# Altium schematic sheet LiPoBattery.SchDoc
size A4; SheetNumber: 1; SheetTotal: 1
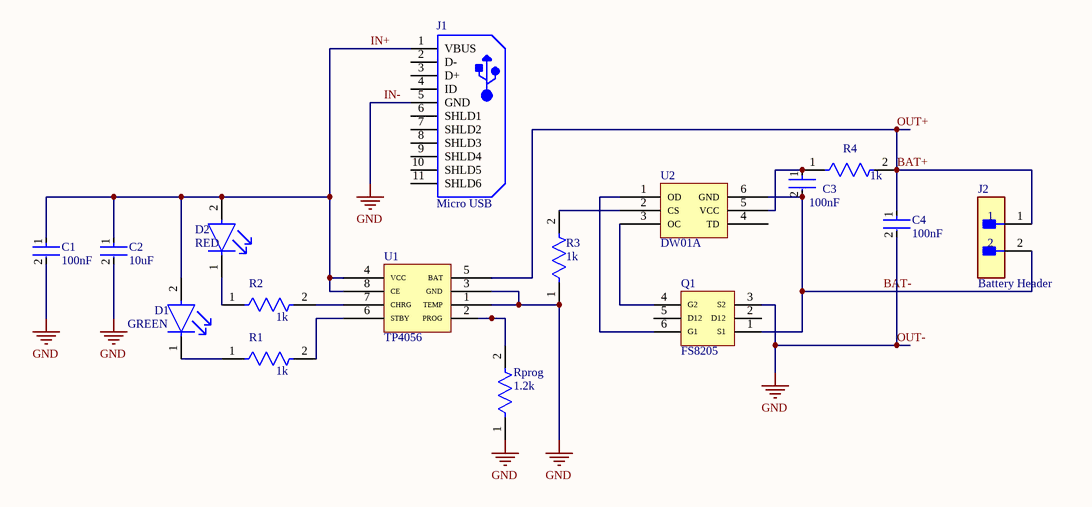
[diagram p0: LiPoBattery.SchDoc]

## Parts
C1  100nF  [FP-CGA3E-0_3-0_1-IPC_B]
C2  10uF  [FP-CGA4J-IPC_B]
C3  100nF  [FP-CGA3E-0_3-0_1-IPC_B]
C4  100nF  [FP-CGA3E-0_3-0_1-IPC_B]
D1  GREEN  [FP-APHCM2012CGCK-F01-MFG]
D2  RED  [FP-LTST-C190KRKT-MFG]
J1  Micro USB  [FCI-10118193-0001LF-5_V]
J2  Battery Header  [FP-B2B-PH-K_LF_SN-MFG]
Q1  FS8205  [SOT95P280X145-6N]
R1  1k  [FP-CRGCQ0402-IPC_C]
R2  1k  [FP-CRGCQ0402-IPC_C]
R3  1k  [FP-CRGCQ0402-IPC_C]
R4  1k  [FP-RNCP0402-IPC_A]
Rprog  1.2k  [FP-MCU0805-MFG]
U1  TP4056  [SOIC127P600X265-8N]
U2  DW01A  [SOT95P280X145-6N]

## Nets
IN-: C1.2 C2.2 C4.2 J1.5(GND) Q1.3(S2) R3.1 Rprog.1 U1.1(TEMP) U1.3(GND)  [also labelled GND, OUT-]
BAT+: C4.1 J2.1 R4.2 U1.5(BAT)  [also labelled OUT+]
BAT-: C3.2 J2.2 Q1.1(S1) U2.6(GND)
IN+: C1.1 C2.1 D1.2(A) D2.2(A) J1.1(VBUS) U1.4(VCC) U1.8(CE)
NetC3_1: C3.1 R4.1 U2.5(VCC)
NetD1_1: D1.1(C) R1.1
NetD2_1: D2.1(C) R2.1
NetQ1_4: Q1.4(G2) U2.3(OC)
NetQ1_6: Q1.6(G1) U2.1(OD)
NetR1_2: R1.2 U1.6(STBY)
NetR2_2: R2.2 U1.7(CHRG)
NetR3_2: R3.2 U2.2(CS)
NetRprog_2: Rprog.2 U1.2(PROG)

Not connected (* = marked no-connect by the designer): J1 2(D-) 3(D+) 4(ID) 6(SHLD1) 7(SHLD2) 8(SHLD3) 9(SHLD4) 10(SHLD5) 11(SHLD6); Q1 2(D12) 5(D12); U2 4(TD)

## Library data of the parts
C1 C3 C4 = CMP-08246-001006-1: Cap Ceramic 100nF 25V X8R 20% Pad SMD 0603 +150°C Automotive T/R; Package Quantity: 4000; Voltage Rating: 25V; Ratings: AEC-Q200; Mount: Surface Mount; Case/Package: 0603; Features: High Temperature; Case Code (Metric): 1608; Height: 0.8mm; Case Code (Imperial): 0603; Min Operating Temperature: -55°C; Packaging: Tape and Reel; Thickness: 0.035inch; Dielectric: X8R; Tolerance: 20%; Width: 0.031inch; Length: 0.063inch; Capacitance: 100nF; Max Operating Temperature: 150°C; Weight: 7.1E-05oz; Voltage Rating (DC): 25V
C2 = CMP-08246-002209-1: Cap Ceramic 10uF 10V X5R 20% Pad SMD 0805 +85°C Automotive T/R; Case Code (Imperial): 0805; Mount: Surface Mount; Min Operating Temperature: -55°C; Tolerance: 20%; Length: 0.079inch; Capacitance: 10uF; Voltage Rating: 10V; Case Code (Metric): 2012; Width: 0.049inch; Ratings: AEC-Q200; Max Operating Temperature: 85°C; Package Quantity: 2000; Thickness: 0.057inch; Packaging: Tape and Reel; Case/Package: 0805
D1 = CMP-44529-000062-1: LED GREEN CLEAR CHIP SMD; Dominant Wavelength: 570nm; Forward Current: 20mA; Number of LEDs: 1; Luminous Intensity: 40mcd; Forward Voltage: 2.1V; Viewing Angle: 110°; Illumination Color: Green; Lens Style: Clear; Mount: Surface Mount; Length: 2mm; Max Operating Temperature: 85°C; Series: APHCM; Width: 1.25mm; Lead Free: Lead Free; Wavelength: 570nm; Package Quantity: 1; Number of Pins: 2; Case Code (Metric): 2012; RoHS Compliant: Yes; Packaging: Tape and Reel; Lens Color: Clear; Case/Package: 0805; Case Code (Imperial): 0805; Test Current: 20mA; Color: Green; Min Operating Temperature: -40°C; Height: 0.4mm
D2 = CMP-1674-00011-2: LED RED CLEAR CHIP SMD; Reverse Voltage: 5V; Viewing Angle: 130°; Power Rating: 75mW; Test Current: 20mA; Number of Elements: 1; Lens Color: Colorless; Wavelength: 639nm; Dominant Wavelength: 631nm; Lens Style: Diffused; Forward Current: 30mA; Forward Voltage: 2.4V; Luminous Intensity: 54mcd; Color: Red; Case Code (Imperial): 0603; Lens Transparency: Clear; Lead Free: Lead Free; Package Quantity: 1; Packaging: Tape and Reel; Max Operating Temperature: 85°C; Number of Pins: 2; Height: 0.8mm; Case/Package: 0603; Number of LEDs: 1; Width: 0.8mm; Case Code (Metric): 1608; Depth: 0.8mm; Mount: Surface Mount; Radiation Hardening: No; Length: 1.6mm; Illumination Color: Red; Power Dissipation: 75mW; Min Operating Temperature: -55°C
J1 = CMP-2000-05119-1: Micro USB B Type Receptacle, -55 to 85 degC, 5-Pin SMD, RoHS, Tape and Reel; Manufacturer: FCI; Insulation Resistance: 1000MOhms; Gender: Female; Current Rating: 1.8A; Number of Contacts: 5Contact; Connector Type: MicroUSBTypeBreceptacle; Mounting Angle: Right; Datasheet Version: Rev. C, 05/2015; Packaging: Reel; Product Category: USBConnectors; Standard: USB2.0; Factory Pack Quantity: 1200; Operating Temperature Range: -55Cto+85C; Termination Style: SMD/SMT; Datasheet URL: http://datasheet.octopart.com/10118193-0001LF-FCI-datasheet-55953155.pdf; Contact Material: CopperAlloy; RoHS: Details; Contact Plating: Gold; Flammability Rating: UL94V-0; Manufacturer URL: http://www.fci.com/; Brand: FCI; Product: MicroUSBTypeBConnectors; Color: Black
J2 = CMP-17439-000674-1: Connector Header Through Hole 2 position 0.079" (2.00mm); Gender: Male; Pitch: 2mm; Voltage Rating: 100V; Current Rating: 2A; Number of Positions: 2; Insulation Resistance: 1GR; Contact Plating: Tin; Color: Beige; Min Operating Temperature: -25°C; Mount: Through Hole; Number of Rows: 1; Termination: Crimp; Max Operating Temperature: 85°C; Lead Free: Lead Free; Contact Material: Brass; Material: Polyamide
R1-R3 = CMP-03211-006314-1: CRGCQ0402 1KΩ 1% ±100ppm/°C 50V; Manufacturer Part Number: CRGCQ0402F1K0; Manufacturer: TE Connectivity; Power Rating: 0.0625W; Tolerance: 0.01; Composition: Thick Film; Voltage Rating: 50V; Device Class L2: Resistors; Package: CRGCQ0402; Temperature Range High: +155°C; Device Class L3: Chip SMD Resistors; Automotive: Yes; Value: 1KΩ; Ambient Temperature Range High: +70°C; Temperature Range Low: -55°C; Temperature: -55°C to +155°C; Resistance: 1KΩ; Device Class L1: Passive Components; Height: 0.4mm; Series: CRGCQ; Lead Free: Yes; ComponentLink2URL: https://www.te.com/commerce/DocumentDelivery/DDEController?Action=showdoc&DocId=Data+Sheet%7F1773204-3%7F1%7Fpdf%7FEnglish%7FENG_DS_1773204-3_1.pdf%7F4-2176347-694; Category: Res; Octopart: https://octopart.com/crgcq0402f1k0-te+connectivity-91017946; RoHS: TRUE; ComponentLink2Description: Datasheet; Ipc Land Pattern Name: RESC10050X35; Temperature Coefficient: ±100ppm/°C
R4 = CMP-26527-007295-1: 100Ω ±1% 0.1W 0402 High Power Anti-Sulfur Thin Film Chip Resistor; Temperature Coefficient: 100ppm/°C; Max Power Dissipation: 100mW; Resistance: 100R; Min Operating Temperature: -55°C; Max Operating Temperature: 155°C; Number of Terminations: 2; RoHS Compliant: Yes; Features: Moisture Resistant; Case/Package: 0402; Tolerance: 1%; Mount: Surface Mount; Packaging: Tape and Reel; Resistor Type: Thin Film
Rprog = CMP-02407-012109-1: RES 1.05K OHM 0.5% 1/5W 0805; Resistance: 1.2kR; Max Power Dissipation: 200mW; Temperature Coefficient: 50ppm/°C; Tolerance: 1%; Max Operating Temperature: 155°C; Resistor Type: Thin Film; Min Operating Temperature: -55°C; Number of Terminations: 2; Contact Plating: Tin; Lead Free: Lead Free; Series: MCU 0805 - Professional; RoHS Compliant: Yes; Length: 0.079inch; Height: 0.022inch; Radiation Hardening: No; Case/Package: 0805; Width: 0.049inch; Package Quantity: 5000; Packaging: Tape and Reel
U1 = TP4056: SOP-8 Battery Management ICs ROHS; Manufacturer Part Number: TP4056
U2 = DW01A: battery protection IC; Manufacturer Part Number: DW01A
Q1 = FS8205: Manufacturer Part Number: FS8205